# Altium schematic sheet 04 - Auxiliary Power.SchDoc: Auxiliary Power - 25kW WolfPACK FM3 Six-Pack Inv. (part 1 of 3)
size 431 x 279 mm; Date: 01/2024; DocumentNumber: CRD25DA12N-FMC; Revision: 1.2; SheetNumber: 4; SheetTotal: 8; SheetSize: B
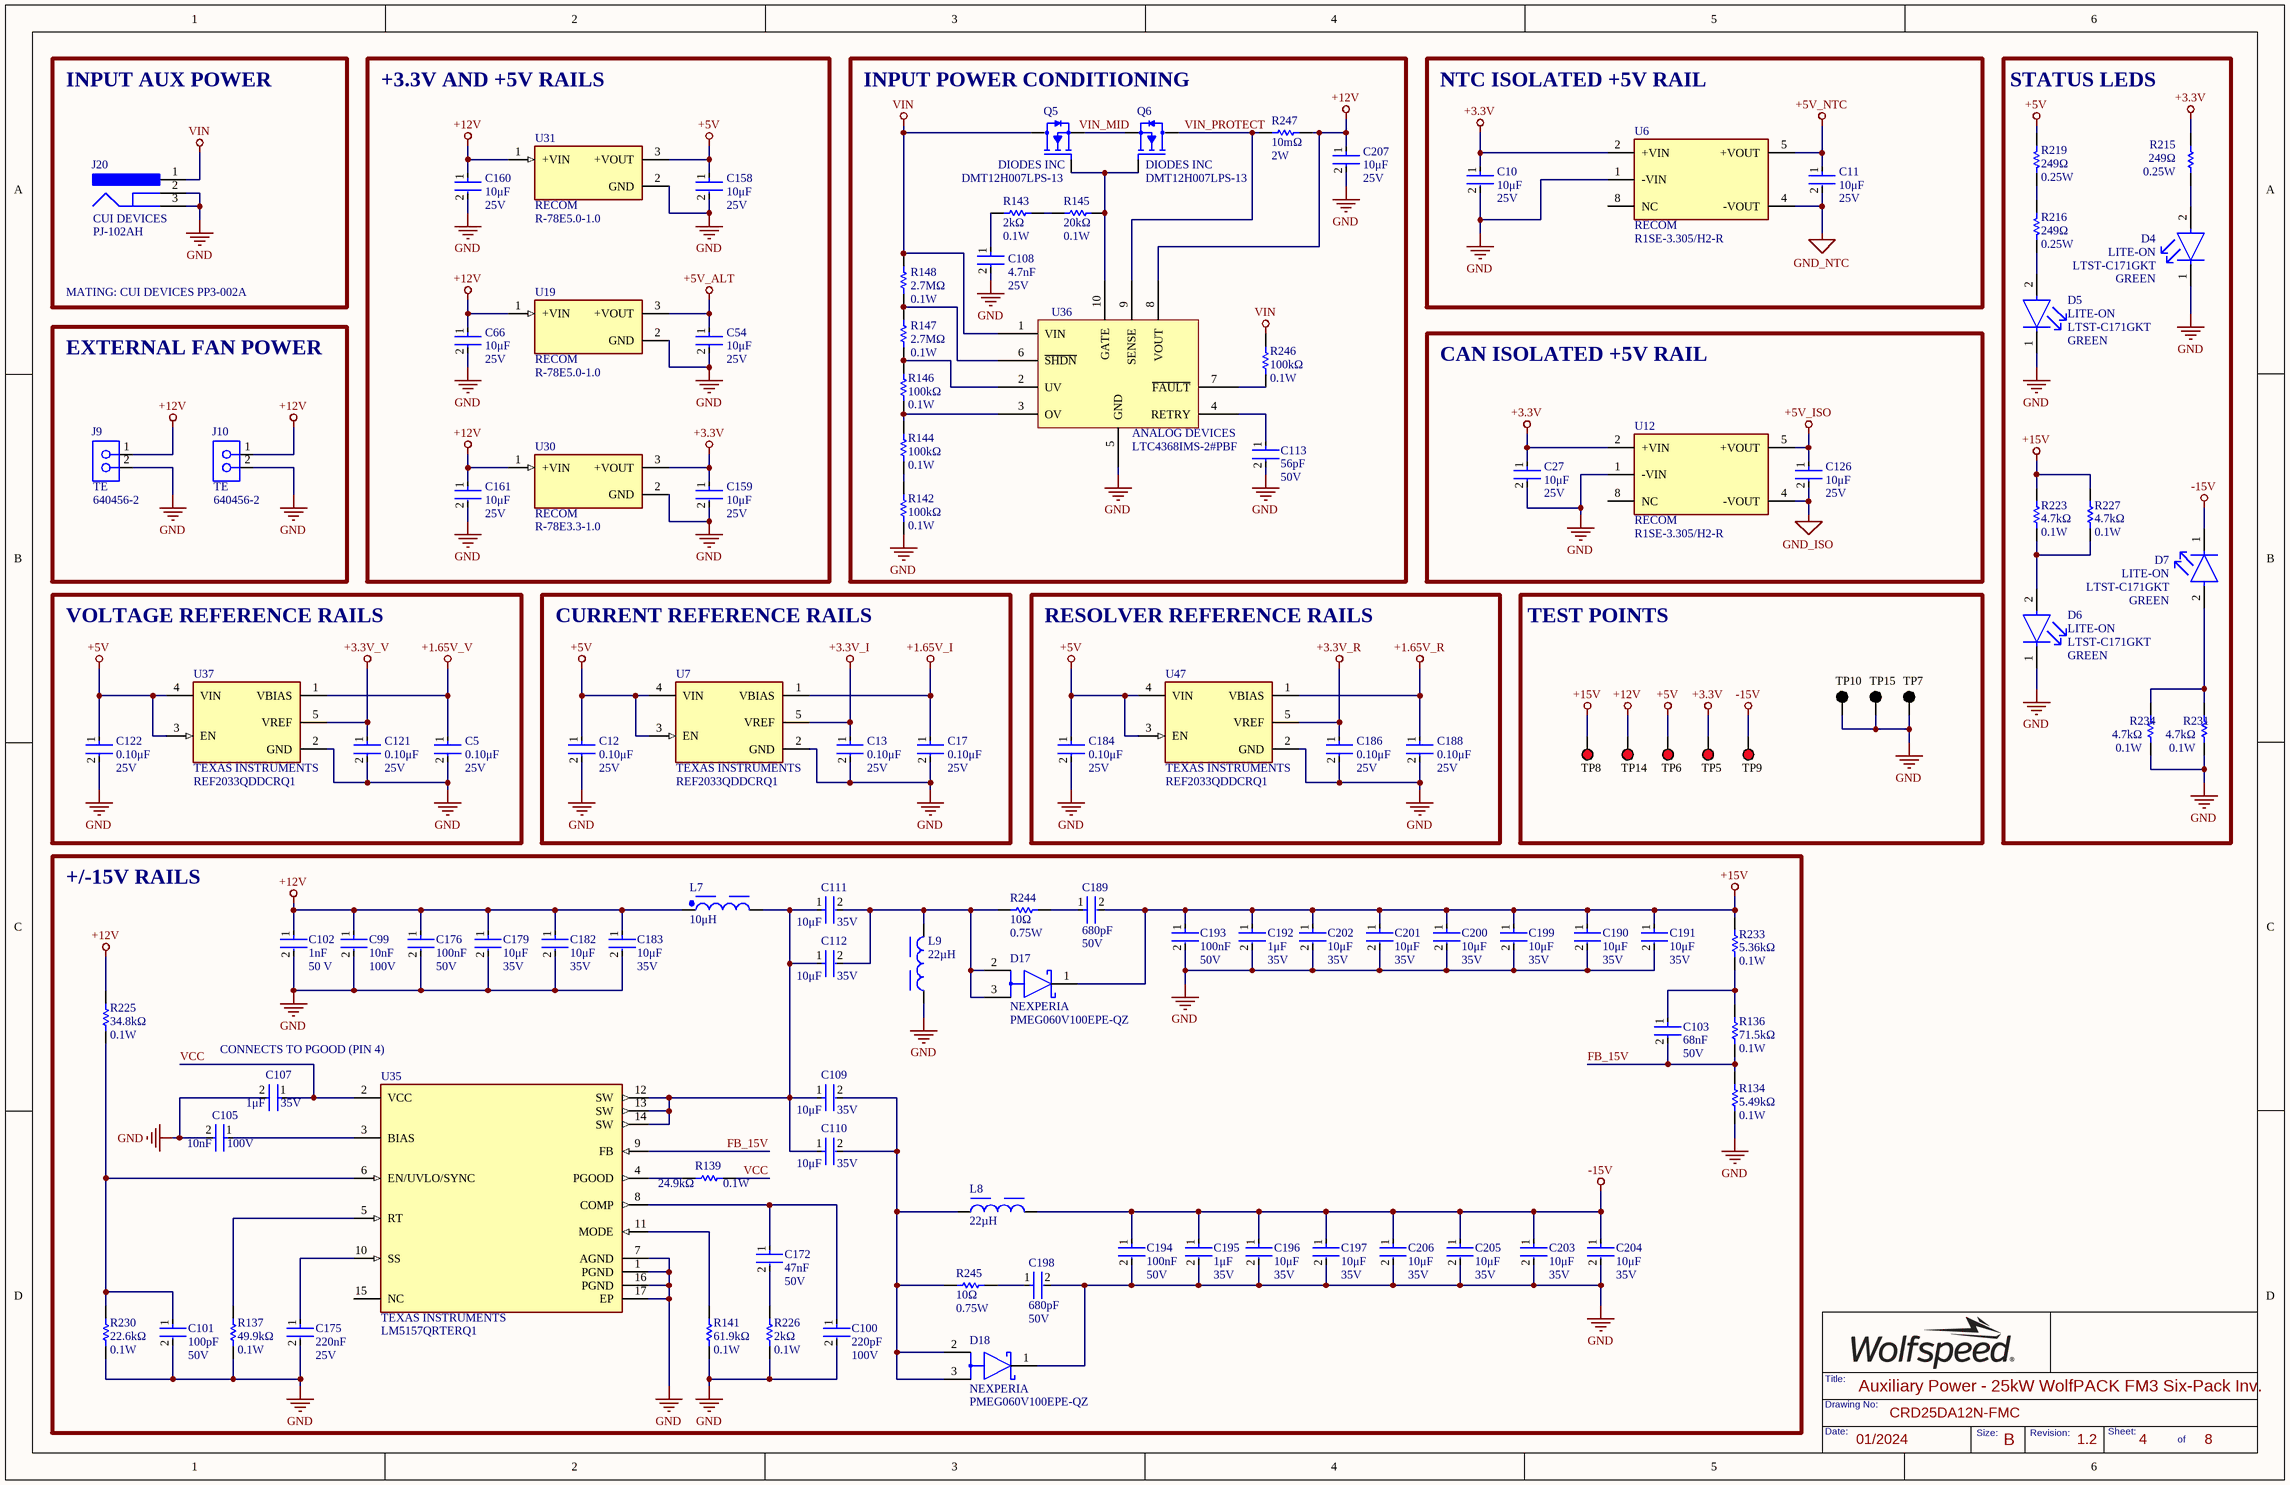
[diagram p0: 04 - Auxiliary Power.SchDoc]

## Parts
C5  Voltage Rating: 25V  Capacitance: 0.10μF  [FP-C0603C-CF-IPC_B]  (hidden comment: C0603C104K3RACTU)
C10  Voltage Rating: 25V  Capacitance: 10μF  [FP-CL31-IPC_B]  (hidden comment: CL31B106KAHSFNE)
C11  Voltage Rating: 25V  Capacitance: 10μF  [FP-CL31-IPC_B]  (hidden comment: CL31B106KAHSFNE)
C12  Voltage Rating: 25V  Capacitance: 0.10μF  [FP-C0603C-CF-IPC_B]  (hidden comment: C0603C104K3RACTU)
C13  Voltage Rating: 25V  Capacitance: 0.10μF  [FP-C0603C-CF-IPC_B]  (hidden comment: C0603C104K3RACTU)
C17  Voltage Rating: 25V  Capacitance: 0.10μF  [FP-C0603C-CF-IPC_B]  (hidden comment: C0603C104K3RACTU)
C27  Voltage Rating: 25V  Capacitance: 10μF  [FP-CL31-IPC_B]  (hidden comment: CL31B106KAHSFNE)
C54  Voltage Rating: 25V  Capacitance: 10μF  [FP-CL31-IPC_B]  (hidden comment: CL31B106KAHSFNE)
C66  Voltage Rating: 25V  Capacitance: 10μF  [FP-CL31-IPC_B]  (hidden comment: CL31B106KAHSFNE)
C99  value 10nF  Voltage Rating: 100V  [FP-C0603C-CF-IPC_B]  (hidden comment: GCM188R72A103KA37D)
C100  value 220pF  Voltage Rating: 100V  [FP-C0603C-CF-IPC_B]  (hidden comment: GCM1885C2A221JA16D)
C101  Capacitance: 100pF  Voltage: 50V  [FP-C0603C-CF-IPC_B]  (hidden comment: CL10C101JB8NNNC)
C102  Capacitance: 1nF  Voltage Rating: 50 V  [FP-C0603C-CF-IPC_B]  (hidden comment: C0603C102K5RACAUTO)
C103  value 68nF  Voltage Rating (DC): 50V  [FP-C0603C-CF-IPC_B]  (hidden comment: CGA3E2X7R1H683K080AA)
C105  value 10nF  Voltage Rating: 100V  [FP-C0603C-CF-IPC_B]  (hidden comment: GCM188R72A103KA37D)
C107  value 1μF  Voltage Rating: 35V  [FP-C0603C-CF-IPC_B]  (hidden comment: CGA3E1X7R1V105K080AC)
C108  Voltage Rating: 25V  Capacitance: 4.7nF  [FP-C0603C-CF-IPC_B]  (hidden comment: C0603C472K3RAC7867)
C109  value 10μF  Voltage Rating: 35V  [FP-C0603C-CF-IPC_B]  (hidden comment: GRM188R6YA106MA73D)
C110  value 10μF  Voltage Rating: 35V  [FP-C0603C-CF-IPC_B]  (hidden comment: GRM188R6YA106MA73D)
C111  value 10μF  Voltage Rating: 35V  [FP-C0603C-CF-IPC_B]  (hidden comment: GRM188R6YA106MA73D)
C112  value 10μF  Voltage Rating: 35V  [FP-C0603C-CF-IPC_B]  (hidden comment: GRM188R6YA106MA73D)
C113  Capacitance: 56pF  Voltage Rating: 50V  [FP-C0603C-CF-IPC_B]  (hidden comment: CL10C560JB8NNNC)
C121  Voltage Rating: 25V  Capacitance: 0.10μF  [FP-C0603C-CF-IPC_B]  (hidden comment: C0603C104K3RACTU)
C122  Voltage Rating: 25V  Capacitance: 0.10μF  [FP-C0603C-CF-IPC_B]  (hidden comment: C0603C104K3RACTU)
C126  Voltage Rating: 25V  Capacitance: 10μF  [FP-CL31-IPC_B]  (hidden comment: CL31B106KAHSFNE)
C158  Voltage Rating: 25V  Capacitance: 10μF  [FP-CL31-IPC_B]  (hidden comment: CL31B106KAHSFNE)
C159  Voltage Rating: 25V  Capacitance: 10μF  [FP-CL31-IPC_B]  (hidden comment: CL31B106KAHSFNE)
C160  Voltage Rating: 25V  Capacitance: 10μF  [FP-CL31-IPC_B]  (hidden comment: CL31B106KAHSFNE)
C161  Voltage Rating: 25V  Capacitance: 10μF  [FP-CL31-IPC_B]  (hidden comment: CL31B106KAHSFNE)
C172  value 47nF  Voltage Rating: 50V  [FP-C0603C-CF-IPC_B]  (hidden comment: CGA3E2X7R1H473K080AA)
C175  Capacitance: 220nF  Voltage: 25V  [FP-C0603C-CF-IPC_B]  (hidden comment: GCM188R71E224KA55D)
C176  value 100nF  Voltage: 50V  [FP-C0603C-CF-IPC_B]  (hidden comment: CGA3E2X7R1H104K080AA)
C179  value 10μF  Voltage Rating: 35V  [FP-C0603C-CF-IPC_B]  (hidden comment: GRM188R6YA106MA73D)
C182  value 10μF  Voltage Rating: 35V  [FP-C0603C-CF-IPC_B]  (hidden comment: GRM188R6YA106MA73D)
C183  value 10μF  Voltage Rating: 35V  [FP-C0603C-CF-IPC_B]  (hidden comment: GRM188R6YA106MA73D)
C184  Voltage Rating: 25V  Capacitance: 0.10μF  [FP-C0603C-CF-IPC_B]  (hidden comment: C0603C104K3RACTU)
C186  Voltage Rating: 25V  Capacitance: 0.10μF  [FP-C0603C-CF-IPC_B]  (hidden comment: C0603C104K3RACTU)
C188  Voltage Rating: 25V  Capacitance: 0.10μF  [FP-C0603C-CF-IPC_B]  (hidden comment: C0603C104K3RACTU)
C189  value 680pF  Voltage: 50V  [FP-C0603C-CF-IPC_B]  (hidden comment: C0603C681J5GACTU)
C190  value 10μF  Voltage Rating: 35V  [FP-C0603C-CF-IPC_B]  (hidden comment: GRM188R6YA106MA73D)
C191  value 10μF  Voltage Rating: 35V  [FP-C0603C-CF-IPC_B]  (hidden comment: GRM188R6YA106MA73D)
C192  value 1μF  Voltage Rating: 35V  [FP-C0603C-CF-IPC_B]  (hidden comment: CGA3E1X7R1V105K080AC)
C193  value 100nF  Voltage: 50V  [FP-C0603C-CF-IPC_B]  (hidden comment: CGA3E2X7R1H104K080AA)
C194  value 100nF  Voltage: 50V  [FP-C0603C-CF-IPC_B]  (hidden comment: CGA3E2X7R1H104K080AA)
C195  value 1μF  Voltage Rating: 35V  [FP-C0603C-CF-IPC_B]  (hidden comment: CGA3E1X7R1V105K080AC)
C196  value 10μF  Voltage Rating: 35V  [FP-C0603C-CF-IPC_B]  (hidden comment: GRM188R6YA106MA73D)
C197  value 10μF  Voltage Rating: 35V  [FP-C0603C-CF-IPC_B]  (hidden comment: GRM188R6YA106MA73D)
C198  value 680pF  Voltage: 50V  [FP-C0603C-CF-IPC_B]  (hidden comment: C0603C681J5GACTU)
C199  value 10μF  Voltage Rating: 35V  [FP-C0603C-CF-IPC_B]  (hidden comment: GRM188R6YA106MA73D)
C200  value 10μF  Voltage Rating: 35V  [FP-C0603C-CF-IPC_B]  (hidden comment: GRM188R6YA106MA73D)
C201  value 10μF  Voltage Rating: 35V  [FP-C0603C-CF-IPC_B]  (hidden comment: GRM188R6YA106MA73D)
C202  value 10μF  Voltage Rating: 35V  [FP-C0603C-CF-IPC_B]  (hidden comment: GRM188R6YA106MA73D)
C203  value 10μF  Voltage Rating: 35V  [FP-C0603C-CF-IPC_B]  (hidden comment: GRM188R6YA106MA73D)
C204  value 10μF  Voltage Rating: 35V  [FP-C0603C-CF-IPC_B]  (hidden comment: GRM188R6YA106MA73D)
C205  value 10μF  Voltage Rating: 35V  [FP-C0603C-CF-IPC_B]  (hidden comment: GRM188R6YA106MA73D)
C206  value 10μF  Voltage Rating: 35V  [FP-C0603C-CF-IPC_B]  (hidden comment: GRM188R6YA106MA73D)
C207  Voltage Rating: 25V  Capacitance: 10μF  [FP-CL31-IPC_B]  (hidden comment: CL31B106KAHSFNE)
D4  value GREEN  Manufacturer: LITE-ON  [FP-LTST-C171GKT-MFG]  (hidden comment: LTST-C171GKT)
D5  value GREEN  Manufacturer: LITE-ON  [FP-LTST-C171GKT-MFG]  (hidden comment: LTST-C171GKT)
D6  value GREEN  Manufacturer: LITE-ON  [FP-LTST-C171GKT-MFG]  (hidden comment: LTST-C171GKT)
D7  value GREEN  Manufacturer: LITE-ON  [FP-LTST-C171GKT-MFG]  (hidden comment: LTST-C171GKT)
D17  Manufacturer: NEXPERIA  [FP-PSMC_TO-277A-MFG]  (hidden comment: PMEG060V100EPE-QZ)
D18  Manufacturer: NEXPERIA  [FP-PSMC_TO-277A-MFG]  (hidden comment: PMEG060V100EPE-QZ)
J9  640456-2  Manufacturer Print: TE  [TECO-640456-2_V]
J10  640456-2  Manufacturer Print: TE  [TECO-640456-2_V]
J20  PJ-102AH  Manufacturer Print: CUI DEVICES  [CUI-PJ-102B_V]
L7  value 10μH  [WE-XHMI_8080_L8.8W8.3H7.8]  (hidden comment: 74439358100)
L8  value 22µH  [74437368220]  (hidden comment: 74437368220)
L9  value 22µH  [74437368220]  (hidden comment: 74437368220)
Q5  DMT12H007LPS-13  Manufacturer: DIODES INC  [FP-PowerDI5060-8-MFG]
Q6  DMT12H007LPS-13  Manufacturer: DIODES INC  [FP-PowerDI5060-8-MFG]
R134  value 5.49kΩ  Power Rating: 0.1W  [FP-MCR03-IPC_B]  (hidden comment: RC0603FR-075K49L)
R136  value 71.5kΩ  Max Power Dissipation: 0.1W  [FP-MCR03-IPC_B]  (hidden comment: RT0603DRE0771K5L)
R137  value 49.9kΩ  Power Rating: 0.1W  [FP-MCR03-IPC_B]  (hidden comment: RT0603FRE0749K9L)
R139  value 24.9kΩ  Power Rating: 0.1W  [FP-MCR03-IPC_B]  (hidden comment: RC0603FR-0724K9L)
R141  value 61.9kΩ  Power Rating: 0.1W  [FP-MCR03-IPC_B]  (hidden comment: RC0603FR-0761K9L)
R142  Resistance: 100kΩ  Power Rating: 0.1W  [FP-MCR03-IPC_B]  (hidden comment: RC0603FR-07100KL)
R143  Resistance: 2kΩ  Power Rating: 0.1W  [FP-MCR03-IPC_B]  (hidden comment: RT0603DRE072KL)
R144  Resistance: 100kΩ  Power Rating: 0.1W  [FP-MCR03-IPC_B]  (hidden comment: RC0603FR-07100KL)
R145  Resistance: 20kΩ  Power Rating: 0.1W  [FP-MCR03-IPC_B]  (hidden comment: CRCW060320K0FKTA)
R146  Resistance: 100kΩ  Power Rating: 0.1W  [FP-MCR03-IPC_B]  (hidden comment: RC0603FR-07100KL)
R147  Power Rating: 0.1W  Resistance: 2.7MΩ  [FP-MCR03-IPC_B]  (hidden comment: RC0603JR-072M7L)
R148  Power Rating: 0.1W  Resistance: 2.7MΩ  [FP-MCR03-IPC_B]  (hidden comment: RC0603JR-072M7L)
R215  Resistance: 249Ω  Power Rating: 0.25W  [FP-MCR18-IPC_A]  (hidden comment: RC1206FR-07249RL)
R216  Resistance: 249Ω  Power Rating: 0.25W  [FP-MCR18-IPC_A]  (hidden comment: RC1206FR-07249RL)
R219  Resistance: 249Ω  Power Rating: 0.25W  [FP-MCR18-IPC_A]  (hidden comment: RC1206FR-07249RL)
R223  Resistance: 4.7kΩ  Power Rating: 0.1W  [FP-MCR03-IPC_B]  (hidden comment: CRCW06034K70FKTA)
R225  value 34.8kΩ  Power Rating: 0.1W  [FP-MCR03-IPC_B]  (hidden comment: RT0603DRE0734K8L)
R226  Resistance: 2kΩ  Power Rating: 0.1W  [FP-MCR03-IPC_B]  (hidden comment: RT0603DRE072KL)
R227  Resistance: 4.7kΩ  Power Rating: 0.1W  [FP-MCR03-IPC_B]  (hidden comment: CRCW06034K70FKTA)
R230  value 22.6kΩ  Max Power Dissipation: 0.1W  [FP-MCR03-IPC_B]  (hidden comment: RT0603DRE0722K6L)
R231  Resistance: 4.7kΩ  Power Rating: 0.1W  [FP-MCR03-IPC_B]  (hidden comment: CRCW06034K70FKTA)
R233  value 5.36kΩ  Power Rating: 0.1W  [FP-MCR03-IPC_B]  (hidden comment: RT0603BRD075K36L)
R234  Resistance: 4.7kΩ  Power Rating: 0.1W  [FP-MCR03-IPC_B]  (hidden comment: CRCW06034K70FKTA)
R244  value 10Ω  Power Rating: 0.75W  [RESC3125X70X40NL20T20]  (hidden comment: CRCW121010R0FKEAHP)
R245  value 10Ω  Power Rating: 0.75W  [RESC3125X70X40NL20T20]  (hidden comment: CRCW121010R0FKEAHP)
R246  Resistance: 100kΩ  Power Rating: 0.1W  [FP-MCR03-IPC_B]  (hidden comment: RC0603FR-07100KL)
R247  Resistance: 10mΩ  Max Power Dissipation: 2W  [FP-RL2512-IPC_A]  (hidden comment: PE2512FKE7W0R01L)
TP5  5010  [KSTN-5010_V]  (value not drawn)
TP6  5010  [KSTN-5010_V]  (value not drawn)
TP7  5011  [KSTN-5011_V]  (value not drawn)
TP8  5010  [KSTN-5010_V]  (value not drawn)
TP9  5010  [KSTN-5010_V]  (value not drawn)
TP10  5011  [KSTN-5011_V]  (value not drawn)
TP14  5010  [KSTN-5010_V]  (value not drawn)
TP15  5011  [KSTN-5011_V]  (value not drawn)
U6  Manufacturer: RECOM  [FP-R1SE-0505-R-MFG]  (hidden comment: R1SE-3.305/H2-R)
U7  Manufacturer: TEXAS INSTRUMENTS  [FP-DDC0005A-MFG]  (hidden comment: REF2033QDDCRQ1)
U12  Manufacturer: RECOM  [FP-R1SE-0505-R-MFG]  (hidden comment: R1SE-3.305/H2-R)
U19  R-78E5.0-1.0  Manufacturer Print: RECOM  [CONV_R-78E5.0-1.0]
U30  R-78E3.3-1.0  Manufacturer Print: RECOM  [CONV_R-78E3.3-1.0]
U31  R-78E5.0-1.0  Manufacturer Print: RECOM  [CONV_R-78E5.0-1.0]
U35  Manufacturer: TEXAS INSTRUMENTS  [FP-RTE0016K-IPC_A]  (hidden comment: LM5157QRTERQ1)
U36  LTC4368IMS-2#PBF  Manufacturer Print: ANALOG DEVICES  [SOP50P490X110-10N]
U37  Manufacturer: TEXAS INSTRUMENTS  [FP-DDC0005A-MFG]  (hidden comment: REF2033QDDCRQ1)
U47  Manufacturer: TEXAS INSTRUMENTS  [FP-DDC0005A-MFG]  (hidden comment: REF2033QDDCRQ1)

## Blocks framed on the sheet
INPUT AUX POWER: J20
+3.3V AND +5V RAILS: C54 C66 C158-C161 U19 U30 U31
INPUT POWER CONDITIONING: C108 C113 C207 Q5 Q6 R142-R148 R246 R247 U36
NTC ISOLATED +5V RAIL: C10 C11 U6
STATUS LEDS: D4-D7 R215 R216 R219 R223 R227 R231 R234
EXTERNAL FAN POWER: J9 J10
CAN ISOLATED +5V RAIL: C27 C126 U12
VOLTAGE REFERENCE RAILS: C5 C121 C122 U37
CURRENT REFERENCE RAILS: C12 C13 C17 U7
RESOLVER REFERENCE RAILS: C184 C186 C188 U47
TEST POINTS: TP5-TP10 TP14 TP15
+/-15V RAILS: C99-C103 C105 C107 C109-C112 C172 C175 C176 C179 C182 C183 C189-C206 D17 D18 L7-L9 R134 R136 R137 R139 R141 R225 R226 R230 R233 R244 R245 U35

## Nets
+1.65V_I: C17.1 U7.1(VBIAS)
+1.65V_R: C188.1 U47.1(VBIAS)
+1.65V_V: C5.1 U37.1(VBIAS)
+3.3V: C10.1 C27.1 C159.1 R215.1 TP5.1 U6.2(+VIN) U12.2(+VIN) U30.3(+VOUT)
+3.3V_I: C13.1 U7.5(VREF)
+3.3V_R: C186.1 U47.5(VREF)
+3.3V_V: C121.1 U37.5(VREF)
+5V: C12.1 C122.1 C158.1 C184.1 R219.1 TP6.1 U7.3(EN) U7.4(VIN) U31.3(+VOUT) U37.3(EN) U37.4(VIN) U47.3(EN) U47.4(VIN)
+5V_ALT: C54.1 U19.3(+VOUT)
+5V_ISO: C126.1 U12.5(+VOUT)
+5V_NTC: C11.1 U6.5(+VOUT)
+12V: C66.1 C99.1 C102.1 C160.1 C161.1 C176.1 C179.1 C182.1 C183.1 C207.1 J9.1 J10.1 L7.1 R225.2 R247.2 TP14.1 U19.1(+VIN) U30.1(+VIN) U31.1(+VIN) U36.8(VOUT)
+15V: C189.2 C190.1 C191.1 C192.1 C193.1 C199.1 C200.1 C201.1 C202.1 D17.1(K) R223.2 R227.2 R233.2 TP8.1
-15V: C194.1 C195.1 C196.1 C197.1 C203.1 C204.1 C205.1 C206.1 D7.1(C) L8.2 TP9.1
GND: C5.2 C10.2 C12.2 C13.2 C17.2 C27.2 C54.2 C66.2 C99.2 C100.2 C101.2 C102.2 C105.2 C107.2 C108.2 C113.2 C121.2 C122.2 C158.2 C159.2 C160.2 C161.2 C175.2 C176.2 C179.2 C182.2 C183.2 C184.2 C186.2 C188.2 C190.2 C191.2 C192.2 C193.2 C194.2 C195.2 C196.2 C197.2 C198.2 C199.2 C200.2 C201.2 C202.2 C203.2 C204.2 C205.2 C206.2 C207.2 D4.1(C) D5.1(C) D6.1(C) D18.1(K) J9.2 J10.2 J20.2 J20.3 L9.1 R134.1 R137.1 R141.1 R142.1 R226.1 R230.1 R231.1 R234.1 TP7.1 TP10.1 TP15.1 U6.1(-VIN) U7.2(GND) U12.1(-VIN) U19.2(GND) U30.2(GND) U31.2(GND) U35.1(PGND) U35.7(AGND) U35.16(PGND) U35.17(EP) U36.5(GND) U37.2(GND) U47.2(GND)
GND_ISO: C126.2 U12.4(-VOUT)
GND_NTC: C11.2 U6.4(-VOUT)
VIN: J20.1 Q5.5(D) R148.2 R246.2 U36.1(VIN)
FB_15V: C103.2 R134.2 R136.1 U35.9(FB)
VCC: C107.1 R139.2 U35.2(VCC)
VIN_MID: Q5.1,2,3(S) Q6.1,2,3(S)
VIN_PROTECT: Q6.5(D) R247.1 U36.9(SENSE)
NetC100_1: C100.1 C172.1 U35.8(COMP)
NetC101_1: C101.1 R225.1 R230.2 U35.6(EN/UVLO/SYNC)
NetC103_1: C103.1 R136.2 R233.1
NetC105_1: C105.1 U35.3(BIAS)
NetC108_1: C108.1 R143.1
NetC109_1: C109.1 C110.1 C111.1 C112.1 L7.2 U35.12(SW) U35.13(SW) U35.14(SW)
NetC109_2: C109.2 C110.2 D18.2(A) D18.3(A) L8.1 R245.1
NetC111_2: C111.2 C112.2 D17.2(A) D17.3(A) L9.2 R244.1
NetC113_1: C113.1 U36.4(RETRY)
NetC172_2: C172.2 R226.2
NetC175_1: C175.1 U35.10(SS)
NetC189_1: C189.1 R244.2
NetC198_1: C198.1 R245.2
NetD4_2: D4.2(A) R215.2
NetD5_2: D5.2(A) R216.2
NetD6_2: D6.2(A) R223.1 R227.1
NetD7_2: D7.2(A) R231.2 R234.2
NetQ5_4: Q5.4(G) Q6.4(G) R145.2 U36.10(GATE)
NetR137_2: R137.2 U35.5(RT)
NetR139_1: R139.1 U35.4(PGOOD)
NetR141_2: R141.2 U35.11(MODE)
NetR142_2: R142.2 R144.1
NetR143_2: R143.2 R145.1
NetR144_2: R144.2 R146.1 U36.3(OV)
NetR146_2: R146.2 R147.1 U36.2(UV)
NetR147_2: R147.2 R148.1 U36.6(~{SHDN})
NetR216_1: R216.1 R219.2
NetR246_1: R246.1 U36.7(~{FAULT})

Not connected (* = marked no-connect by the designer): U6 8(NC); U12 8(NC); U35 15(NC)

## Notes on the sheet
- MATING: CUI DEVICES PP3-002A
- CONNECTS TO PGOOD (PIN 4)
- Title:
- Date:
- Drawing No:
- Size:
- Revision:
- Sheet:
- of